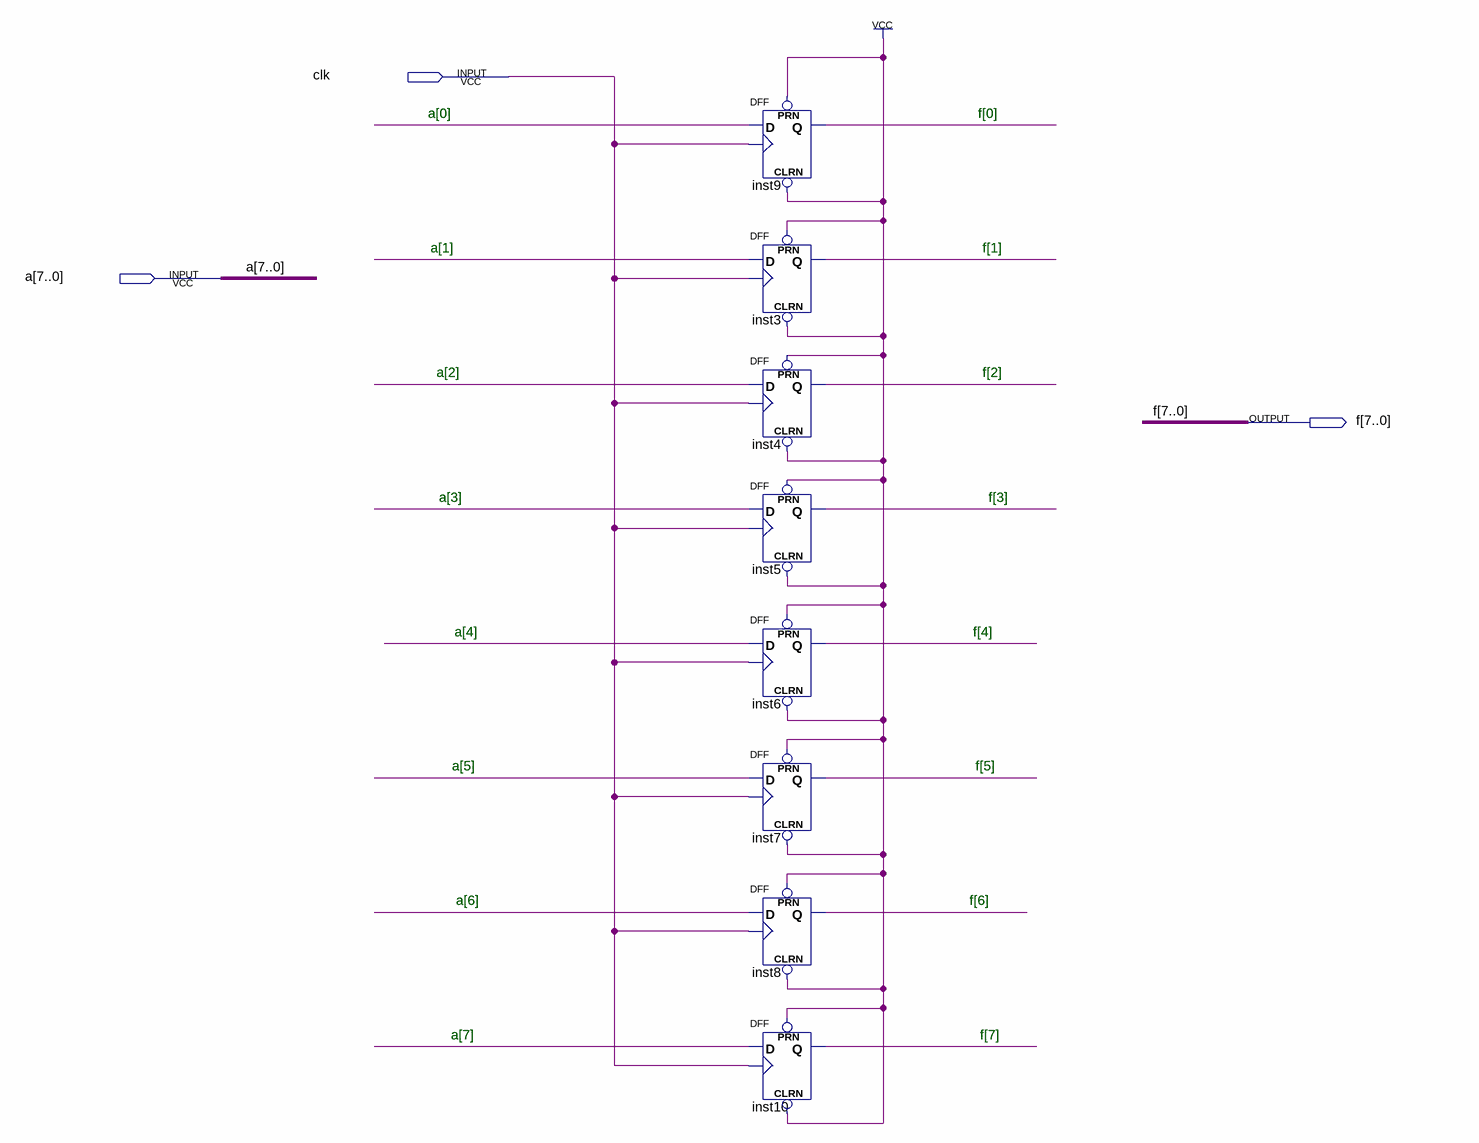
[diagram p0: schematic sheet]
// Quartus schematic register.bdf as structural Verilog: 8 symbols, 3 pins
module register (
  input  clk,
  input  [7:0] a,
  output [7:0] f
);

  DFF inst9 (.CLRN(1'b1), .CLK(clk), .D(a[0]), .PRN(1'b1), .Q(f[0]));
  DFF inst3 (.CLRN(1'b1), .CLK(clk), .D(a[1]), .PRN(1'b1), .Q(f[1]));
  DFF inst4 (.CLRN(1'b1), .CLK(clk), .D(a[2]), .PRN(1'b1), .Q(f[2]));
  DFF inst5 (.CLRN(1'b1), .CLK(clk), .D(a[3]), .PRN(1'b1), .Q(f[3]));
  DFF inst6 (.CLRN(1'b1), .CLK(clk), .D(a[4]), .PRN(1'b1), .Q(f[4]));
  DFF inst7 (.CLRN(1'b1), .CLK(clk), .D(a[5]), .PRN(1'b1), .Q(f[5]));
  DFF inst8 (.CLRN(1'b1), .CLK(clk), .D(a[6]), .PRN(1'b1), .Q(f[6]));
  DFF inst10 (.CLRN(1'b1), .CLK(clk), .D(a[7]), .PRN(1'b1), .Q(f[7]));

  // Notes on the sheet:
  //   a[0]
  //   f[0]
  //   a[1]
  //   f[1]
  //   a[2]
  //   f[2]
  //   a[3]
  //   f[3]
  //   a[4]
  //   f[4]
  //   a[5]
  //   f[5]
  //   a[6]
  //   f[6]
  //   a[7]
  //   f[7]
endmodule
